# Altium schematic sheet Mod_Intan_v1.SchDoc
size A4
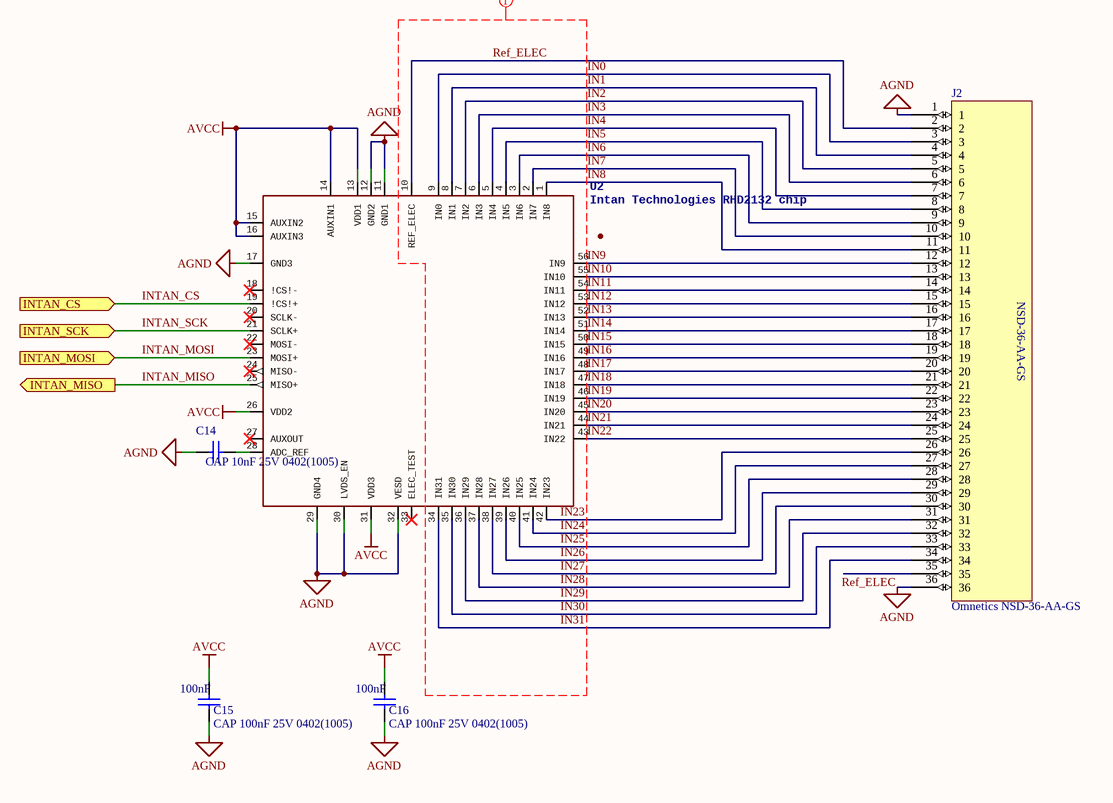
[diagram p0: Mod_Intan_v1.SchDoc]

## Parts
C14  CAP 10nF 25V 0402(1005)  [CAPC0402(1005)60_L]
C15  CAP 100nF 25V 0402(1005)  value 100nF  [CAPC0402(1005)60_L]
C16  CAP 100nF 25V 0402(1005)  value 100nF  [CAPC0402(1005)60_L]
J2  Omnetics NSD-36-AA-GS  [NSD-36-AA-GS]
U2  Intan Technologies RHD2132 chip  [QFN56_large]

## Ports
INTAN_CS (in), INTAN_MISO (out), INTAN_MOSI (in), INTAN_SCK (in)

## Nets
AGND: C14.1 C15.1 C16.1 J2.1 J2.36 U2.11(GND1) U2.12(GND2) U2.17(GND3) U2.29(GND4) U2.30(LVDS_EN) U2.32(VESD)
AVCC: C15.2 C16.2 U2.13(VDD1) U2.14(AUXIN1) U2.15(AUXIN2) U2.16(AUXIN3) U2.26(VDD2) U2.31(VDD3)
IN0: J2.3 U2.9(IN0)
IN1: J2.4 U2.8(IN1)
IN2: J2.5 U2.7(IN2)
IN3: J2.6 U2.6(IN3)
IN4: J2.7 U2.5(IN4)
IN5: J2.8 U2.4(IN5)
IN6: J2.9 U2.3(IN6)
IN7: J2.10 U2.2(IN7)
IN8: J2.11 U2.1(IN8)
IN9: J2.12 U2.56(IN9)
IN10: J2.13 U2.55(IN10)
IN11: J2.14 U2.54(IN11)
IN12: J2.15 U2.53(IN12)
IN13: J2.16 U2.52(IN13)
IN14: J2.17 U2.51(IN14)
IN15: J2.18 U2.50(IN15)
IN16: J2.19 U2.49(IN16)
IN17: J2.20 U2.48(IN17)
IN18: J2.21 U2.47(IN18)
IN19: J2.22 U2.46(IN19)
IN20: J2.23 U2.45(IN20)
IN21: J2.24 U2.44(IN21)
IN22: J2.25 U2.43(IN22)
IN23: J2.26 U2.42(IN23)
IN24: J2.27 U2.41(IN24)
IN25: J2.28 U2.40(IN25)
IN26: J2.29 U2.39(IN26)
IN27: J2.30 U2.38(IN27)
IN28: J2.31 U2.37(IN28)
IN29: J2.32 U2.36(IN29)
IN30: J2.33 U2.35(IN30)
IN31: J2.34 U2.34(IN31)
INTAN_CS: U2.19(!CS!+) ; port INTAN_CS
INTAN_MISO: U2.25(MISO+) ; port INTAN_MISO
INTAN_MOSI: U2.23(MOSI+) ; port INTAN_MOSI
INTAN_SCK: U2.21(SCLK+) ; port INTAN_SCK
Ref_ELEC: J2.2 J2.35 U2.10(REF_ELEC)
NetC14_2: C14.2 U2.28(ADC_REF)

Not connected (* = marked no-connect by the designer): U2 18(!CS!-)* 20(SCLK-)* 22(MOSI-)* 24(MISO-)* 27(AUXOUT)* 33(ELEC_TEST)*

## Layout directives
net class Undefined: IN0, IN1, IN2, IN3, IN4, IN5, IN6, IN7, IN8, IN9, IN10, IN11, IN12, IN13, IN14, IN15, IN16, IN17, IN18, IN19, IN20, IN21, IN22, IN23, IN24, IN25, IN26, IN27, IN28, IN29, IN30, IN31, Ref_ELEC

## Library data of the parts
C14 = CMP-1034-01879-1: CAP 10nF 25V ±5% 0402 (1005 Metric) Thickness 0.6mm SMD; Case-Metric: 1005; Case-EIA: 0402; Value: 10nF; Tolerance: ±5%; Technology: SMT; Max Thickness: 0.6 mm; Rated Voltage: 25 V
C15 C16 = CMP-1034-02072-1: CAP 100nF 25V ±10% 0402 (1005 Metric) Thickness 0.6mm SMD; Case-Metric: 1005; Case-EIA: 0402; Technology: SMT; Tolerance: ±10%; Rated Voltage: 25 V; Max Thickness: 0.6 mm
J2 = Omnetics NSD-36-AA-GS: NSD-36-AA-GS; Part Number: A79025-001
U2 = RHD2132_QFN